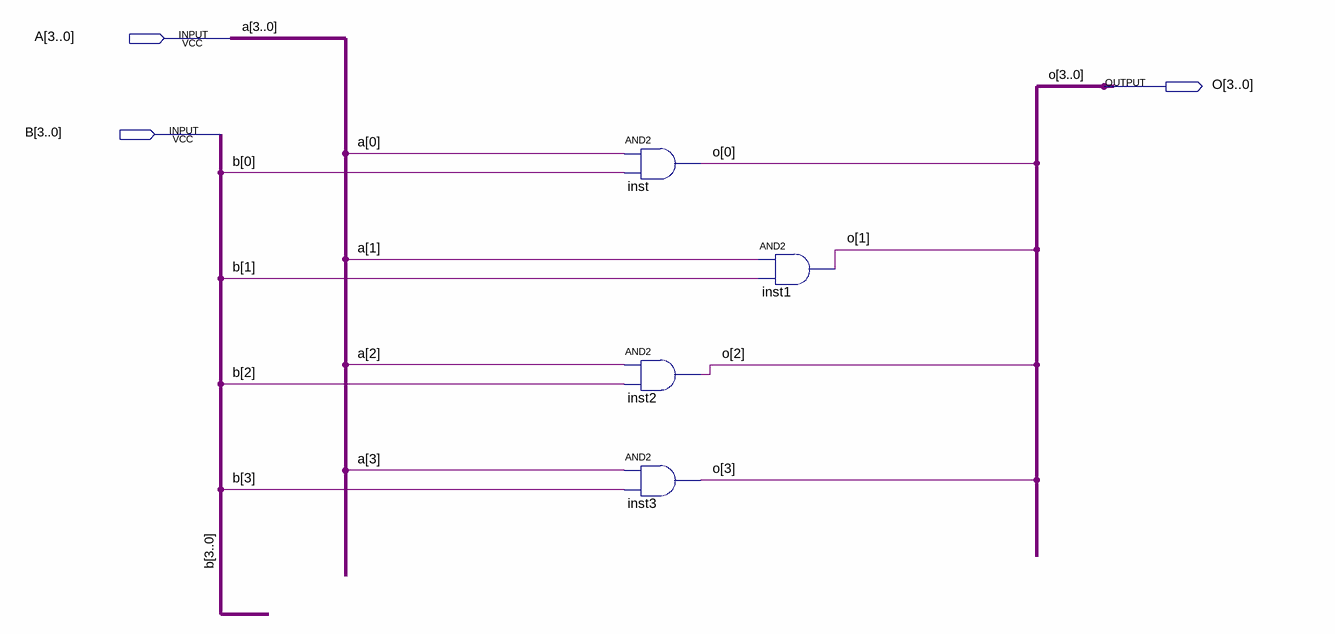
[diagram p0: schematic sheet]
// Quartus schematic 4bit_and.bdf as structural Verilog: 4 symbols, 3 pins
module \4bit_and  (
  input  [3:0] A,
  input  [3:0] B,
  output [3:0] O
);

  and inst (O[0], A[0], B[0]);
  and inst2 (O[2], A[2], B[2]);
  and inst3 (O[3], A[3], B[3]);
  and inst1 (O[1], A[1], B[1]);
endmodule
